# Altium schematic sheet power-v0v675.SchDoc: Copper Suicide - Power 0.675V
size Letter; CheckedBy: E. Chiu; CompanyName: Signal Laboratories, Inc.; DrawnBy: J. Brinton; Engineer: J. Brinton; Address1: 3479 Edison Way; Address2: Menlo Park CA 94025; Address3: +1 (877) 778-8435; Address4: siglabs.com; Revision: 1; SheetNumber: 40; SheetTotal: 43
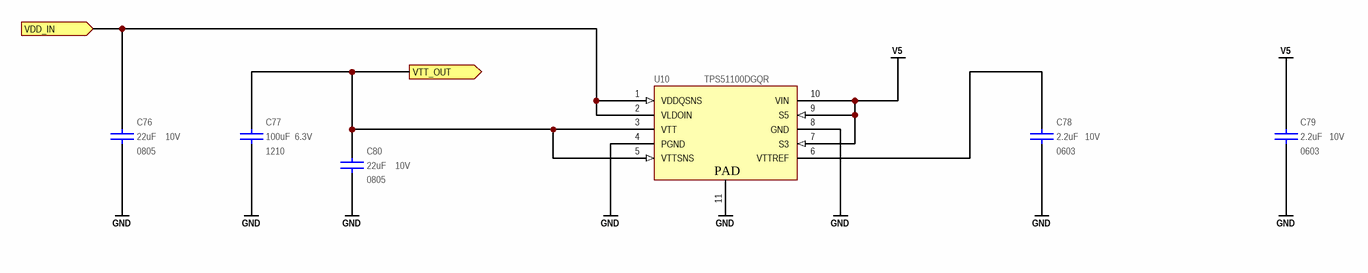
[diagram p0: power-v0v675.SchDoc]

## Parts
C76  value 22uF  Voltage: 10V  Package: 0805  [CAPC200X125X145L45N]  (hidden comment: C2012X7S1A226M125)
C77  value 100uF  Voltage: 6.3V  Package: 1210  [CAPC320X250X280L50N]  (hidden comment: C3225X6S0J107M250)
C78  value 2.2uF  Voltage: 10V  Package: 0603  [CAPC160X80X90L20N]  (hidden comment: C1608X7R1A225M080)
C79  value 2.2uF  Voltage: 10V  Package: 0603  [CAPC160X80X90L20N]  (hidden comment: C1608X7R1A225M080)
C80  value 22uF  Voltage: 10V  Package: 0805  [CAPC200X125X145L45N]  (hidden comment: C2012X7S1A226M125)
U10  TPS51100DGQR  [SOP11P50_300X490X110L55X22T157X188N]

## Ports
VDD_IN (in), VTT_OUT (out)

## Nets
GND: C76.1 C77.2 C78.1 C79.1 C80.1 U10.4(PGND) U10.8(GND) U10.11(PAD)
V5: C79.2 U10.7(S3) U10.9(S5) U10.10(VIN)
VDD_IN: C76.2 U10.1(VDDQSNS) U10.2(VLDOIN) ; port VDD_IN
VTT_OUT: C77.1 C80.2 U10.3(VTT) U10.5(VTTSNS) ; port VTT_OUT
NetC78_2: C78.2 U10.6(VTTREF)

## Notes on the sheet
- Title
- Engineer
- Revision
- Drawn By
- Checked By
- Date
- Sheet
- of

## Library data of the parts
C76 C80 = CAP: Ceramic Capacitor 22uF ±20% 10V X7S 0805; Manufacturer: TDK; Tr: -55:125; Manufacturer P/N: C2012X7S1A226M125; Tolerance: ±20%
C77 = CAP: Ceramic Capacitor 100uF ±20% 6.3V X6S 1210; Manufacturer: TDK; Tr: -55:105; Manufacturer P/N: C3225X6S0J107M250; Tolerance: ±20%
C78 C79 = CAP: Ceramic Capacitor 2.2uF ±20% 10V X7R 0603; Manufacturer: TDK; Tr: -55:125; Manufacturer P/N: C1608X7R1A225M080; Tolerance: ±20%; Footprint: *
U10 = TPS51100DGQR: IC Voltage Reg DDR1/2/3 VTT; Manufacturer: Texas Instruments; Value: TPS51100DGQR; Manufacturer P/N: TPS51100DGQR